# Altium schematic sheet Top.SchDoc
size B
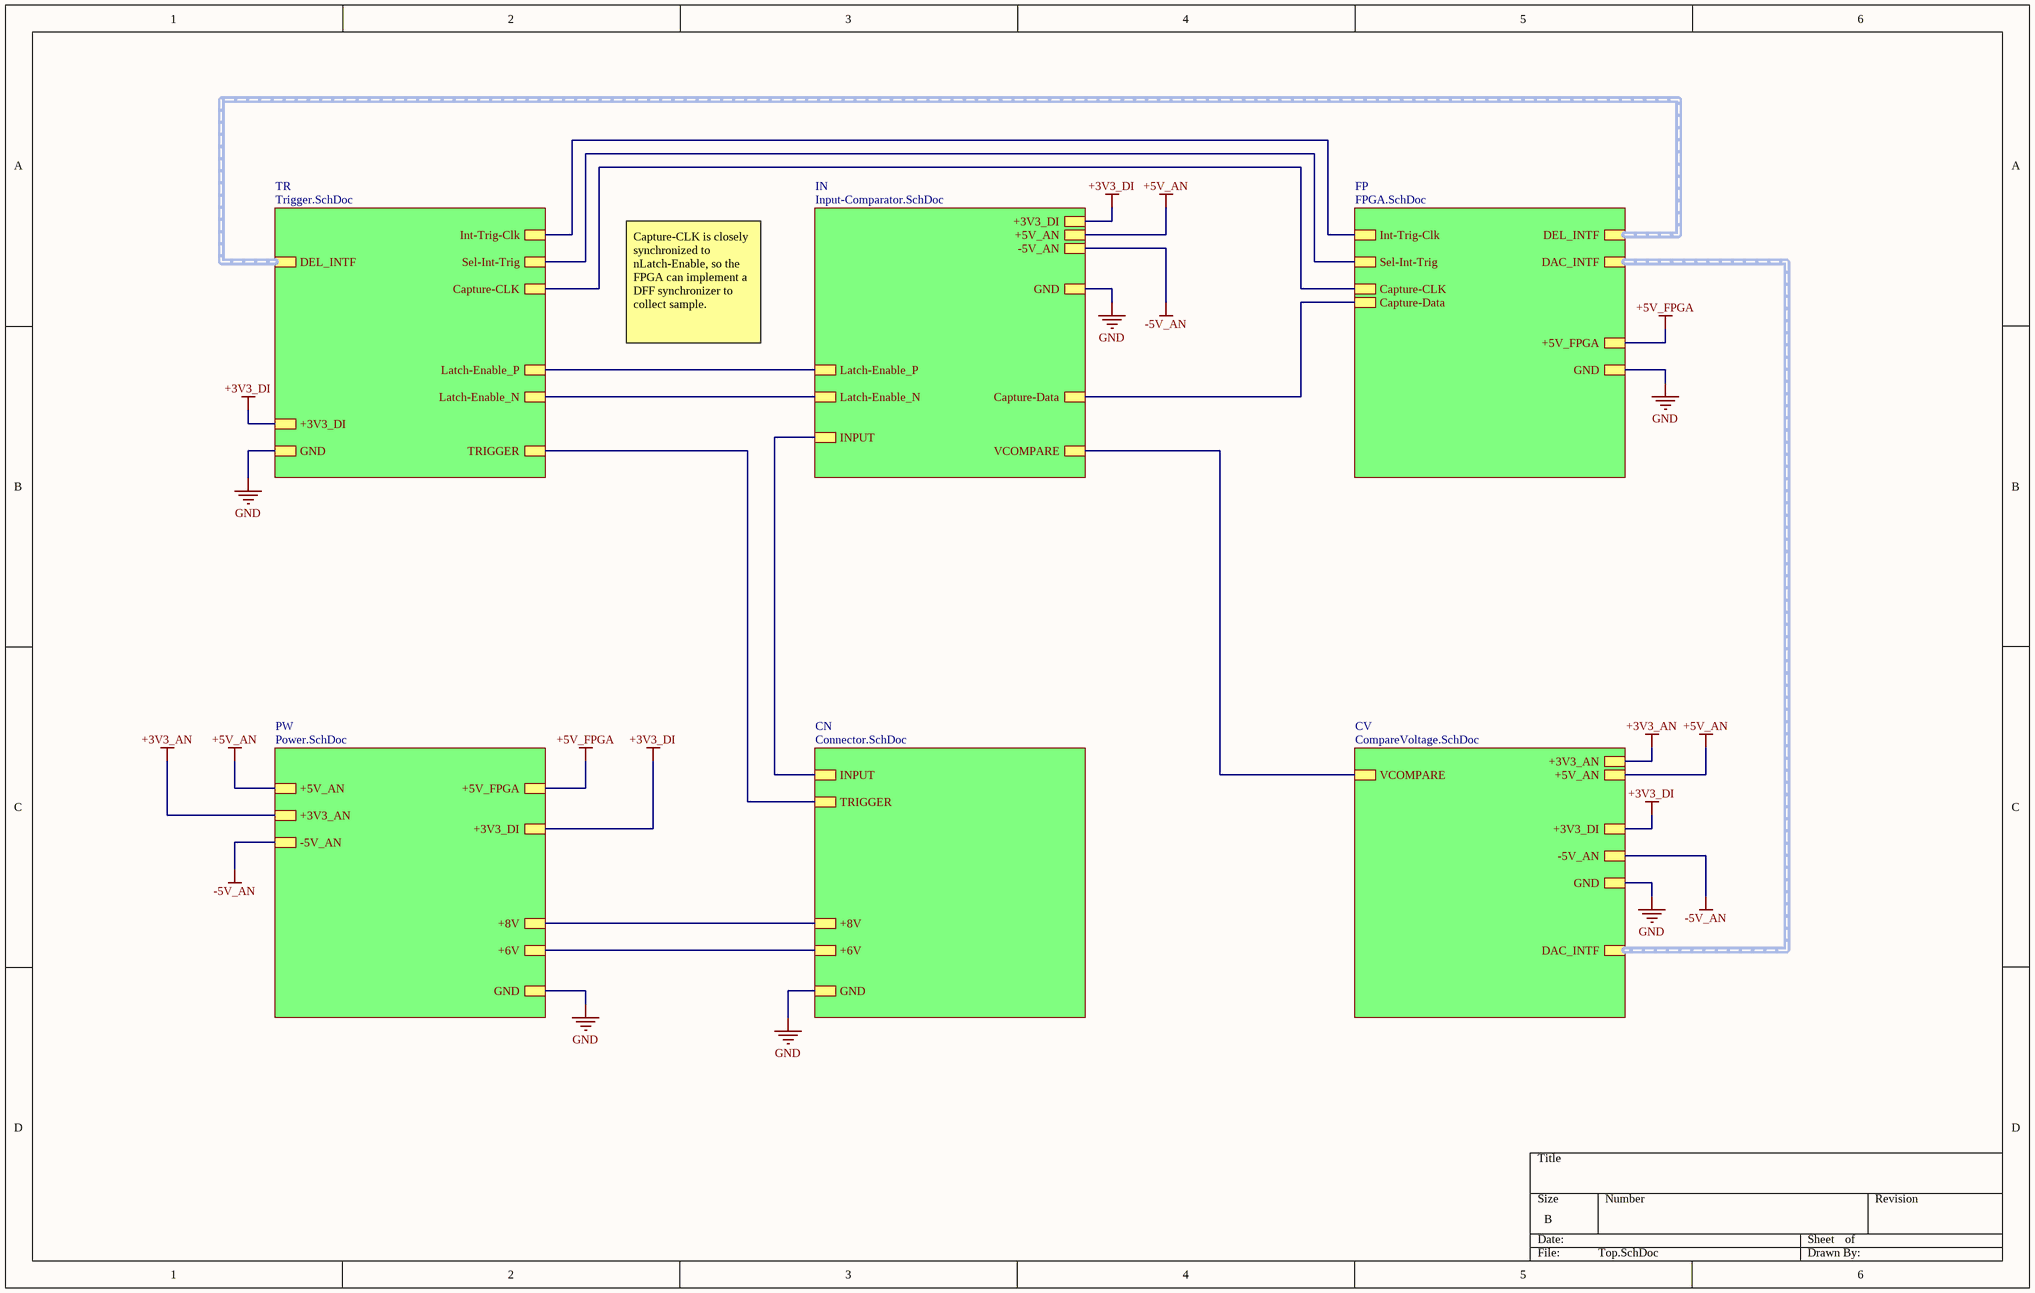
[diagram p0: Top.SchDoc]

## Sub-sheets
CN = Connector.SchDoc: GND, INPUT, TRIGGER, +6V, +8V
CV = CompareVoltage.SchDoc: VCOMPARE, GND, +3V3_AN, +5V_AN, -5V_AN, DAC_INTF (harness DAC_PINS), +3V3_DI
FP = FPGA.SchDoc: DAC_INTF (harness DAC_PINS), +5V_FPGA, GND, Capture-CLK, Int-Trig-Clk, Sel-Int-Trig, DEL_INTF (harness DAC_PINS), Capture-Data
IN = Input-Comparator.SchDoc: GND, +3V3_DI, +5V_AN, -5V_AN, VCOMPARE, INPUT, Latch-Enable_P, Latch-Enable_N, Capture-Data
PW = Power.SchDoc: +5V_FPGA, GND, +3V3_AN, +5V_AN, +3V3_DI, -5V_AN, +6V, +8V
TR = Trigger.SchDoc: TRIGGER, GND, +3V3_DI, Latch-Enable_P, Latch-Enable_N, Sel-Int-Trig, Capture-CLK, Int-Trig-Clk, DEL_INTF

## Nets
+3V3_AN: sheet PW/+3V3_AN, sheet CV/+3V3_AN
+3V3_DI: sheet TR/+3V3_DI, sheet IN/+3V3_DI, sheet PW/+3V3_DI, sheet CV/+3V3_DI
+5V_AN: sheet IN/+5V_AN, sheet PW/+5V_AN, sheet CV/+5V_AN
+5V_FPGA: sheet FP/+5V_FPGA, sheet PW/+5V_FPGA
-5V_AN: sheet IN/-5V_AN, sheet PW/-5V_AN, sheet CV/-5V_AN
GND: sheet TR/GND, sheet IN/GND, sheet FP/GND, sheet PW/GND, sheet CN/GND, sheet CV/GND
(unnamed): sheet TR/TRIGGER, sheet CN/TRIGGER
(unnamed): sheet TR/Latch-Enable_P, sheet IN/Latch-Enable_P
(unnamed): sheet TR/Latch-Enable_N, sheet IN/Latch-Enable_N
(unnamed): sheet TR/Sel-Int-Trig, sheet FP/Sel-Int-Trig
(unnamed): sheet TR/Capture-CLK, sheet FP/Capture-CLK
(unnamed): sheet TR/Int-Trig-Clk, sheet FP/Int-Trig-Clk
(unnamed): sheet IN/VCOMPARE, sheet CV/VCOMPARE
(unnamed): sheet IN/INPUT, sheet CN/INPUT
(unnamed): sheet IN/Capture-Data, sheet FP/Capture-Data
(unnamed): sheet PW/+6V, sheet CN/+6V
(unnamed): sheet PW/+8V, sheet CN/+8V

## Buses and harness runs
harness sheet CV/DAC_INTF = sheet FP/DAC_INTF
harness sheet FP/DEL_INTF = sheet TR/DEL_INTF

## Notes on the sheet
- Capture-CLK is closely synchronized to nLatch-Enable, so the FPGA can implement a DFF synchronizer to collect sample.